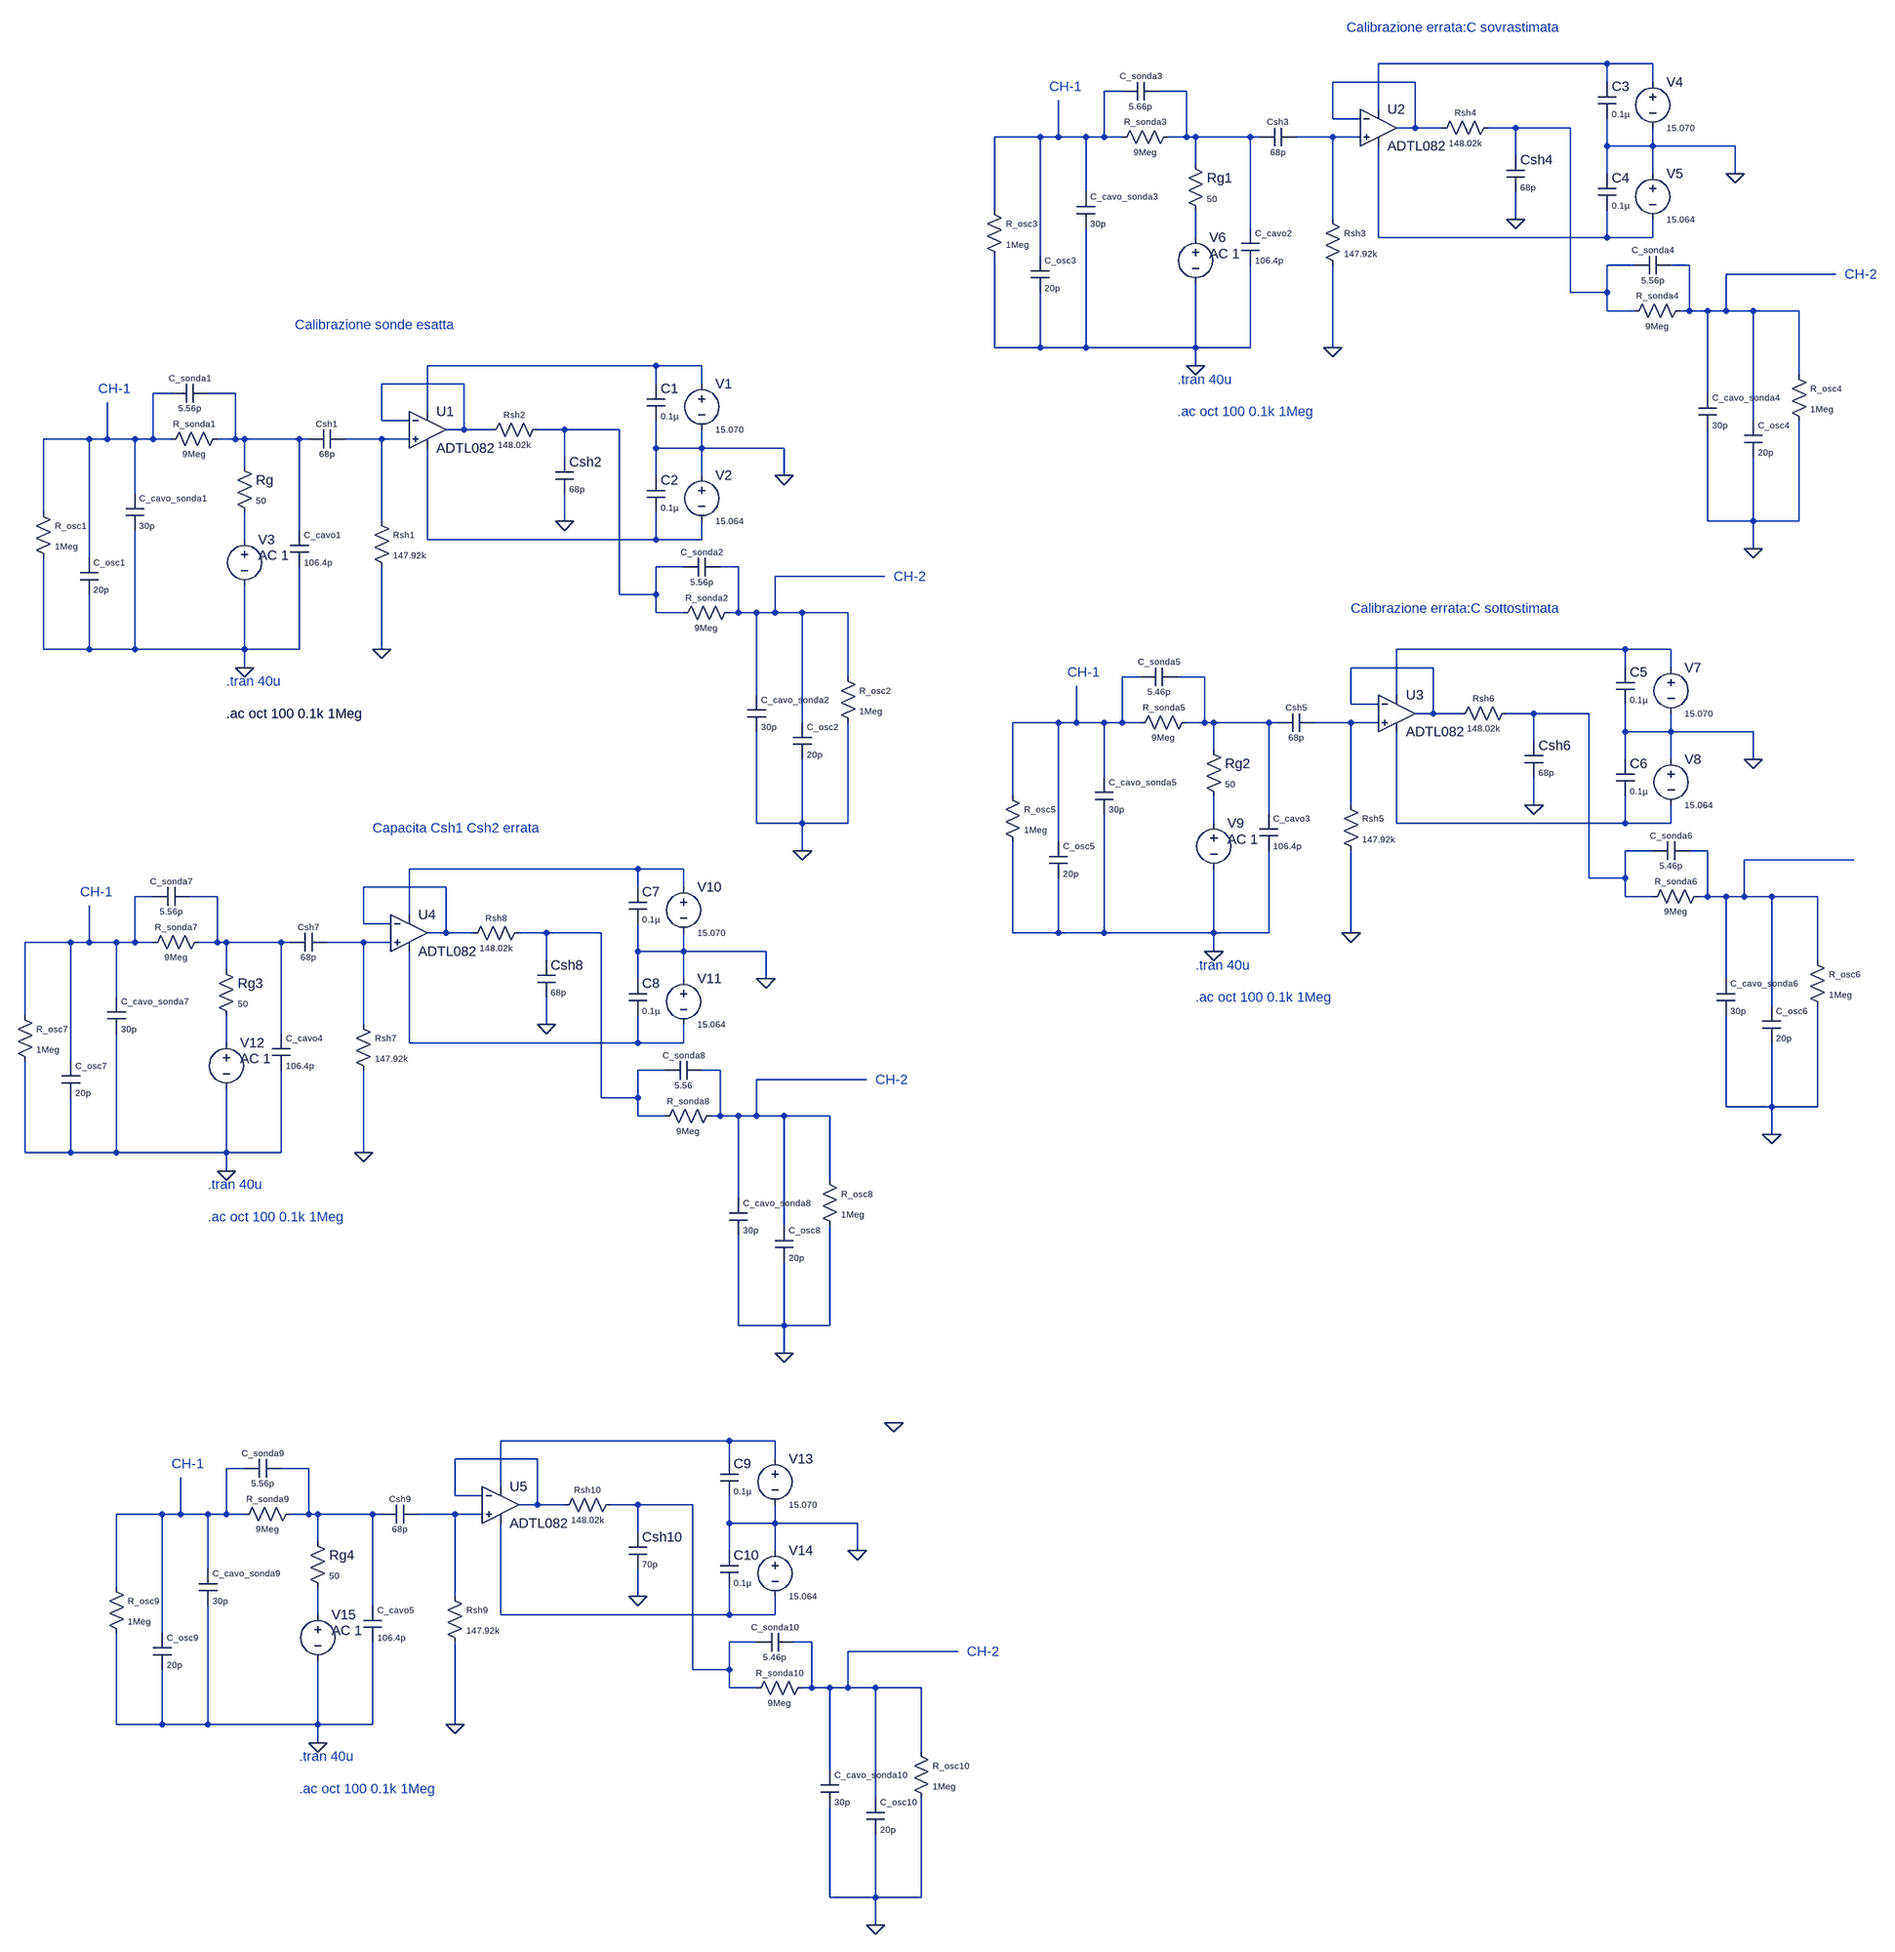
[diagram p0: schematic Shaper_AnFreq2.asc]
Shaper_AnFreq2.asc, the LTspice schematic file:
Version 4.1
SHEET 1 4492 2692
WIRE 2080 -624 1680 -624
WIRE 2160 -624 2080 -624
WIRE 1744 -592 1600 -592
WIRE 2080 -592 2080 -624
WIRE 2160 -592 2160 -624
WIRE 1232 -576 1200 -576
WIRE 1344 -576 1296 -576
WIRE 1680 -544 1680 -624
WIRE 1600 -528 1600 -592
WIRE 1648 -528 1600 -528
WIRE 1744 -512 1744 -592
WIRE 1744 -512 1712 -512
WIRE 1792 -512 1744 -512
WIRE 1920 -512 1872 -512
WIRE 2016 -512 1920 -512
WIRE 1088 -496 1008 -496
WIRE 1120 -496 1120 -560
WIRE 1120 -496 1088 -496
WIRE 1168 -496 1120 -496
WIRE 1200 -496 1200 -576
WIRE 1200 -496 1168 -496
WIRE 1232 -496 1200 -496
WIRE 1344 -496 1344 -576
WIRE 1344 -496 1312 -496
WIRE 1360 -496 1344 -496
WIRE 1456 -496 1360 -496
WIRE 1472 -496 1456 -496
WIRE 1600 -496 1536 -496
WIRE 1648 -496 1600 -496
WIRE 2080 -480 2080 -528
WIRE 2160 -480 2160 -512
WIRE 2160 -480 2080 -480
WIRE 2304 -480 2160 -480
WIRE 1920 -464 1920 -512
WIRE 1360 -448 1360 -496
WIRE 2080 -432 2080 -480
WIRE 2160 -432 2160 -480
WIRE 2304 -432 2304 -480
WIRE 1168 -400 1168 -496
WIRE 1008 -368 1008 -496
WIRE 1600 -352 1600 -496
WIRE 1920 -352 1920 -400
WIRE 1456 -336 1456 -496
WIRE 1360 -320 1360 -368
WIRE 1680 -320 1680 -480
WIRE 2080 -320 2080 -368
WIRE 2080 -320 1680 -320
WIRE 2160 -320 2160 -352
WIRE 2160 -320 2080 -320
WIRE 1088 -288 1088 -496
WIRE 2128 -272 2080 -272
WIRE 2224 -272 2192 -272
WIRE 2480 -256 2288 -256
WIRE 2016 -224 2016 -512
WIRE 2080 -224 2080 -272
WIRE 2080 -224 2016 -224
WIRE 2080 -192 2080 -224
WIRE 2128 -192 2080 -192
WIRE 2224 -192 2224 -272
WIRE 2224 -192 2208 -192
WIRE 2256 -192 2224 -192
WIRE 2288 -192 2288 -256
WIRE 2288 -192 2256 -192
WIRE 2336 -192 2288 -192
WIRE 2416 -192 2336 -192
WIRE 1008 -128 1008 -288
WIRE 1088 -128 1088 -224
WIRE 1088 -128 1008 -128
WIRE 1168 -128 1168 -336
WIRE 1168 -128 1088 -128
WIRE 1360 -128 1360 -240
WIRE 1360 -128 1168 -128
WIRE 1456 -128 1456 -272
WIRE 1456 -128 1360 -128
WIRE 1600 -128 1600 -272
WIRE 416 -96 16 -96
WIRE 496 -96 416 -96
WIRE 1360 -96 1360 -128
WIRE 2416 -80 2416 -192
WIRE 80 -64 -64 -64
WIRE 416 -64 416 -96
WIRE 496 -64 496 -96
WIRE -432 -48 -464 -48
WIRE -320 -48 -368 -48
WIRE 2256 -48 2256 -192
WIRE 16 -16 16 -96
WIRE -64 0 -64 -64
WIRE -16 0 -64 0
WIRE 2336 0 2336 -192
WIRE 80 16 80 -64
WIRE 80 16 48 16
WIRE 128 16 80 16
WIRE 256 16 208 16
WIRE 352 16 256 16
WIRE -576 32 -656 32
WIRE -544 32 -544 -32
WIRE -544 32 -576 32
WIRE -496 32 -544 32
WIRE -464 32 -464 -48
WIRE -464 32 -496 32
WIRE -432 32 -464 32
WIRE -320 32 -320 -48
WIRE -320 32 -352 32
WIRE -304 32 -320 32
WIRE -208 32 -304 32
WIRE -192 32 -208 32
WIRE -64 32 -128 32
WIRE -16 32 -64 32
WIRE 416 48 416 0
WIRE 496 48 496 16
WIRE 496 48 416 48
WIRE 640 48 496 48
WIRE 256 64 256 16
WIRE -304 80 -304 32
WIRE 416 96 416 48
WIRE 496 96 496 48
WIRE 640 96 640 48
WIRE -496 128 -496 32
WIRE -656 160 -656 32
WIRE -64 176 -64 32
WIRE 256 176 256 128
WIRE 2256 176 2256 16
WIRE 2336 176 2336 64
WIRE 2336 176 2256 176
WIRE 2416 176 2416 0
WIRE 2416 176 2336 176
WIRE -208 192 -208 32
WIRE -304 208 -304 160
WIRE 16 208 16 48
WIRE 416 208 416 160
WIRE 416 208 16 208
WIRE 496 208 496 176
WIRE 496 208 416 208
WIRE 2336 224 2336 176
WIRE -576 240 -576 32
WIRE 464 256 416 256
WIRE 560 256 528 256
WIRE 816 272 624 272
WIRE 352 304 352 16
WIRE 416 304 416 256
WIRE 416 304 352 304
WIRE 416 336 416 304
WIRE 464 336 416 336
WIRE 560 336 560 256
WIRE 560 336 544 336
WIRE 592 336 560 336
WIRE 624 336 624 272
WIRE 624 336 592 336
WIRE 672 336 624 336
WIRE 752 336 672 336
WIRE -656 400 -656 240
WIRE -576 400 -576 304
WIRE -576 400 -656 400
WIRE -496 400 -496 192
WIRE -496 400 -576 400
WIRE -304 400 -304 288
WIRE -304 400 -496 400
WIRE -208 400 -208 256
WIRE -208 400 -304 400
WIRE -64 400 -64 256
WIRE 2112 400 1712 400
WIRE 2192 400 2112 400
WIRE -304 432 -304 400
WIRE 1776 432 1632 432
WIRE 2112 432 2112 400
WIRE 2192 432 2192 400
WIRE 752 448 752 336
WIRE 1264 448 1232 448
WIRE 1376 448 1328 448
WIRE 592 480 592 336
WIRE 1712 480 1712 400
WIRE 1632 496 1632 432
WIRE 1680 496 1632 496
WIRE 1776 512 1776 432
WIRE 1776 512 1744 512
WIRE 1824 512 1776 512
WIRE 1952 512 1904 512
WIRE 2048 512 1952 512
WIRE 672 528 672 336
WIRE 1120 528 1040 528
WIRE 1152 528 1152 464
WIRE 1152 528 1120 528
WIRE 1200 528 1152 528
WIRE 1232 528 1232 448
WIRE 1232 528 1200 528
WIRE 1264 528 1232 528
WIRE 1376 528 1376 448
WIRE 1376 528 1344 528
WIRE 1392 528 1376 528
WIRE 1488 528 1392 528
WIRE 1504 528 1488 528
WIRE 1632 528 1568 528
WIRE 1680 528 1632 528
WIRE 2112 544 2112 496
WIRE 2192 544 2192 512
WIRE 2192 544 2112 544
WIRE 2336 544 2192 544
WIRE 1952 560 1952 512
WIRE 1392 576 1392 528
WIRE 2112 592 2112 544
WIRE 2192 592 2192 544
WIRE 2336 592 2336 544
WIRE 1200 624 1200 528
WIRE 1040 656 1040 528
WIRE 1632 672 1632 528
WIRE 1952 672 1952 624
WIRE 1488 688 1488 528
WIRE 592 704 592 544
WIRE 672 704 672 592
WIRE 672 704 592 704
WIRE 752 704 752 528
WIRE 752 704 672 704
WIRE 1392 704 1392 656
WIRE 1712 704 1712 544
WIRE 2112 704 2112 656
WIRE 2112 704 1712 704
WIRE 2192 704 2192 672
WIRE 2192 704 2112 704
WIRE 1120 736 1120 528
WIRE 672 752 672 704
WIRE 2160 752 2112 752
WIRE 2256 752 2224 752
WIRE 2512 768 2320 768
WIRE 384 784 -16 784
WIRE 464 784 384 784
WIRE 2048 800 2048 512
WIRE 2112 800 2112 752
WIRE 2112 800 2048 800
WIRE 48 816 -96 816
WIRE 384 816 384 784
WIRE 464 816 464 784
WIRE -464 832 -496 832
WIRE -352 832 -400 832
WIRE 2112 832 2112 800
WIRE 2160 832 2112 832
WIRE 2256 832 2256 752
WIRE 2256 832 2240 832
WIRE 2288 832 2256 832
WIRE 2320 832 2320 768
WIRE 2320 832 2288 832
WIRE 2368 832 2320 832
WIRE 2448 832 2368 832
WIRE -16 864 -16 784
WIRE -96 880 -96 816
WIRE -48 880 -96 880
WIRE 48 896 48 816
WIRE 48 896 16 896
WIRE 96 896 48 896
WIRE 224 896 176 896
WIRE 320 896 224 896
WIRE 1040 896 1040 736
WIRE 1120 896 1120 800
WIRE 1120 896 1040 896
WIRE 1200 896 1200 688
WIRE 1200 896 1120 896
WIRE 1392 896 1392 784
WIRE 1392 896 1200 896
WIRE 1488 896 1488 752
WIRE 1488 896 1392 896
WIRE 1632 896 1632 752
WIRE -608 912 -688 912
WIRE -576 912 -576 848
WIRE -576 912 -608 912
WIRE -528 912 -576 912
WIRE -496 912 -496 832
WIRE -496 912 -528 912
WIRE -464 912 -496 912
WIRE -352 912 -352 832
WIRE -352 912 -384 912
WIRE -336 912 -352 912
WIRE -240 912 -336 912
WIRE -224 912 -240 912
WIRE -96 912 -160 912
WIRE -48 912 -96 912
WIRE 384 928 384 880
WIRE 464 928 464 896
WIRE 464 928 384 928
WIRE 608 928 464 928
WIRE 1392 928 1392 896
WIRE 224 944 224 896
WIRE 2448 944 2448 832
WIRE -336 960 -336 912
WIRE 384 976 384 928
WIRE 464 976 464 928
WIRE 608 976 608 928
WIRE 2288 976 2288 832
WIRE -528 1008 -528 912
WIRE 2368 1024 2368 832
WIRE -688 1040 -688 912
WIRE -96 1056 -96 912
WIRE 224 1056 224 1008
WIRE -240 1072 -240 912
WIRE -336 1088 -336 1040
WIRE -16 1088 -16 928
WIRE 384 1088 384 1040
WIRE 384 1088 -16 1088
WIRE 464 1088 464 1056
WIRE 464 1088 384 1088
WIRE -608 1120 -608 912
WIRE 432 1136 384 1136
WIRE 528 1136 496 1136
WIRE 784 1152 592 1152
WIRE 320 1184 320 896
WIRE 384 1184 384 1136
WIRE 384 1184 320 1184
WIRE 2288 1200 2288 1040
WIRE 2368 1200 2368 1088
WIRE 2368 1200 2288 1200
WIRE 2448 1200 2448 1024
WIRE 2448 1200 2368 1200
WIRE 384 1216 384 1184
WIRE 432 1216 384 1216
WIRE 528 1216 528 1136
WIRE 528 1216 512 1216
WIRE 560 1216 528 1216
WIRE 592 1216 592 1152
WIRE 592 1216 560 1216
WIRE 640 1216 592 1216
WIRE 720 1216 640 1216
WIRE 2368 1248 2368 1200
WIRE -688 1280 -688 1120
WIRE -608 1280 -608 1184
WIRE -608 1280 -688 1280
WIRE -528 1280 -528 1072
WIRE -528 1280 -608 1280
WIRE -336 1280 -336 1168
WIRE -336 1280 -528 1280
WIRE -240 1280 -240 1136
WIRE -240 1280 -336 1280
WIRE -96 1280 -96 1136
WIRE -336 1312 -336 1280
WIRE 720 1328 720 1216
WIRE 560 1360 560 1216
WIRE 640 1408 640 1216
WIRE 560 1584 560 1424
WIRE 640 1584 640 1472
WIRE 640 1584 560 1584
WIRE 720 1584 720 1408
WIRE 720 1584 640 1584
WIRE 640 1632 640 1584
WIRE 544 1824 144 1824
WIRE 624 1824 544 1824
WIRE 208 1856 64 1856
WIRE 544 1856 544 1824
WIRE 624 1856 624 1824
WIRE -304 1872 -336 1872
WIRE -192 1872 -240 1872
WIRE 144 1904 144 1824
WIRE 64 1920 64 1856
WIRE 112 1920 64 1920
WIRE 208 1936 208 1856
WIRE 208 1936 176 1936
WIRE 256 1936 208 1936
WIRE 384 1936 336 1936
WIRE 480 1936 384 1936
WIRE -448 1952 -528 1952
WIRE -416 1952 -416 1888
WIRE -416 1952 -448 1952
WIRE -368 1952 -416 1952
WIRE -336 1952 -336 1872
WIRE -336 1952 -368 1952
WIRE -304 1952 -336 1952
WIRE -192 1952 -192 1872
WIRE -192 1952 -224 1952
WIRE -176 1952 -192 1952
WIRE -80 1952 -176 1952
WIRE -64 1952 -80 1952
WIRE 64 1952 0 1952
WIRE 112 1952 64 1952
WIRE 544 1968 544 1920
WIRE 624 1968 624 1936
WIRE 624 1968 544 1968
WIRE 768 1968 624 1968
WIRE 384 1984 384 1936
WIRE -176 2000 -176 1952
WIRE 544 2016 544 1968
WIRE 624 2016 624 1968
WIRE 768 2016 768 1968
WIRE -368 2048 -368 1952
WIRE -528 2080 -528 1952
WIRE 64 2096 64 1952
WIRE 384 2096 384 2048
WIRE -80 2112 -80 1952
WIRE -176 2128 -176 2080
WIRE 144 2128 144 1968
WIRE 544 2128 544 2080
WIRE 544 2128 144 2128
WIRE 624 2128 624 2096
WIRE 624 2128 544 2128
WIRE -448 2160 -448 1952
WIRE 592 2176 544 2176
WIRE 688 2176 656 2176
WIRE 944 2192 752 2192
WIRE 480 2224 480 1936
WIRE 544 2224 544 2176
WIRE 544 2224 480 2224
WIRE 544 2256 544 2224
WIRE 592 2256 544 2256
WIRE 688 2256 688 2176
WIRE 688 2256 672 2256
WIRE 720 2256 688 2256
WIRE 752 2256 752 2192
WIRE 752 2256 720 2256
WIRE 800 2256 752 2256
WIRE 880 2256 800 2256
WIRE -528 2320 -528 2160
WIRE -448 2320 -448 2224
WIRE -448 2320 -528 2320
WIRE -368 2320 -368 2112
WIRE -368 2320 -448 2320
WIRE -176 2320 -176 2208
WIRE -176 2320 -368 2320
WIRE -80 2320 -80 2176
WIRE -80 2320 -176 2320
WIRE 64 2320 64 2176
WIRE -176 2352 -176 2320
WIRE 880 2368 880 2256
WIRE 720 2400 720 2256
WIRE 800 2448 800 2256
WIRE 720 2624 720 2464
WIRE 800 2624 800 2512
WIRE 800 2624 720 2624
WIRE 880 2624 880 2448
WIRE 880 2624 800 2624
WIRE 800 2672 800 2624
FLAG -304 432 0
FLAG 672 752 0
FLAG -64 400 0
FLAG 640 96 0
FLAG 256 176 0
FLAG 1360 -96 0
FLAG 2336 224 0
FLAG 1600 -128 0
FLAG 2304 -432 0
FLAG 1920 -352 0
FLAG 1392 928 0
FLAG 2368 1248 0
FLAG 1632 896 0
FLAG 2336 592 0
FLAG 1952 672 0
FLAG -336 1312 0
FLAG 640 1632 0
FLAG -96 1280 0
FLAG 608 976 0
FLAG 224 1056 0
FLAG 832 1792 0
FLAG -176 2352 0
FLAG 800 2672 0
FLAG 64 2320 0
FLAG 768 2016 0
FLAG 384 2096 0
SYMBOL OpAmps\\ADTL082 16 -48 R0
SYMATTR InstName U1
SYMBOL voltage 496 -80 R0
WINDOW 3 24 96 Left 1
WINDOW 123 0 0 Left 0
WINDOW 39 0 0 Left 0
SYMATTR Value 15.070
SYMATTR InstName V1
SYMBOL voltage 496 80 R0
WINDOW 3 24 96 Left 1
WINDOW 123 0 0 Left 0
WINDOW 39 0 0 Left 0
SYMATTR Value 15.064
SYMATTR InstName V2
SYMBOL cap 400 -64 R0
WINDOW 3 24 56 Left 1
SYMATTR Value 0.1µ
SYMATTR InstName C1
SYMBOL cap 400 96 R0
WINDOW 3 24 56 Left 1
SYMATTR Value 0.1µ
SYMATTR InstName C2
SYMBOL voltage -304 192 R0
WINDOW 123 24 44 Left 2
WINDOW 39 0 0 Left 0
WINDOW 3 24 44 Left 2
SYMATTR Value2 AC 1
SYMATTR Value ""
SYMATTR InstName V3
SYMBOL res -320 64 R0
WINDOW 3 36 76 Left 1
SYMATTR Value 50
SYMATTR InstName Rg
SYMBOL res -336 16 R90
WINDOW 0 0 56 VBottom 1
WINDOW 3 32 56 VTop 1
SYMATTR InstName R_sonda1
SYMATTR Value 9Meg
SYMBOL cap -368 -64 R90
WINDOW 0 0 32 VBottom 1
WINDOW 3 32 32 VTop 1
SYMATTR InstName C_sonda1
SYMATTR Value 5.56p
SYMBOL res -672 144 R0
WINDOW 0 36 40 Left 1
WINDOW 3 36 76 Left 1
SYMATTR InstName R_osc1
SYMATTR Value 1Meg
SYMBOL cap -592 240 R0
WINDOW 0 24 8 Left 1
WINDOW 3 24 56 Left 1
SYMATTR InstName C_osc1
SYMATTR Value 20p
SYMBOL cap -512 128 R0
WINDOW 0 24 8 Left 1
WINDOW 3 24 56 Left 1
SYMATTR InstName C_cavo_sonda1
SYMATTR Value 30p
SYMBOL res 560 320 R90
WINDOW 0 0 56 VBottom 1
WINDOW 3 32 56 VTop 1
SYMATTR InstName R_sonda2
SYMATTR Value 9Meg
SYMBOL cap 528 240 R90
WINDOW 0 0 32 VBottom 1
WINDOW 3 32 32 VTop 1
SYMATTR InstName C_sonda2
SYMATTR Value 5.56p
SYMBOL cap 576 480 R0
WINDOW 0 24 8 Left 1
WINDOW 3 24 56 Left 1
SYMATTR InstName C_cavo_sonda2
SYMATTR Value 30p
SYMBOL cap 656 528 R0
WINDOW 0 24 8 Left 1
WINDOW 3 24 56 Left 1
SYMATTR InstName C_osc2
SYMATTR Value 20p
SYMBOL res 736 432 R0
WINDOW 0 36 40 Left 1
WINDOW 3 36 76 Left 1
SYMATTR InstName R_osc2
SYMATTR Value 1Meg
SYMBOL cap -224 256 M180
WINDOW 0 24 56 Left 1
WINDOW 3 24 8 Left 1
SYMATTR InstName C_cavo1
SYMATTR Value 106.4p
SYMBOL res -80 160 R0
WINDOW 0 36 40 Left 1
WINDOW 3 36 76 Left 1
SYMATTR InstName Rsh1
SYMATTR Value 147.92k
SYMBOL cap -128 16 R90
WINDOW 0 0 32 VBottom 1
WINDOW 3 32 32 VTop 1
SYMATTR InstName Csh1
SYMATTR Value 68p
SYMBOL res 224 0 R90
WINDOW 0 0 56 VBottom 1
WINDOW 3 32 56 VTop 1
SYMATTR InstName Rsh2
SYMATTR Value 148.02k
SYMBOL cap 240 64 R0
WINDOW 3 24 56 Left 1
SYMATTR Value 68p
SYMATTR InstName Csh2
SYMBOL OpAmps\\ADTL082 1680 -576 R0
SYMATTR InstName U2
SYMBOL voltage 2160 -608 R0
WINDOW 3 24 96 Left 1
WINDOW 123 0 0 Left 0
WINDOW 39 0 0 Left 0
SYMATTR Value 15.070
SYMATTR InstName V4
SYMBOL voltage 2160 -448 R0
WINDOW 3 24 96 Left 1
WINDOW 123 0 0 Left 0
WINDOW 39 0 0 Left 0
SYMATTR Value 15.064
SYMATTR InstName V5
SYMBOL cap 2064 -592 R0
WINDOW 3 24 56 Left 1
SYMATTR Value 0.1µ
SYMATTR InstName C3
SYMBOL cap 2064 -432 R0
WINDOW 3 24 56 Left 1
SYMATTR Value 0.1µ
SYMATTR InstName C4
SYMBOL voltage 1360 -336 R0
WINDOW 123 24 44 Left 2
WINDOW 39 0 0 Left 0
WINDOW 3 24 44 Left 2
SYMATTR Value2 AC 1
SYMATTR Value ""
SYMATTR InstName V6
SYMBOL res 1344 -464 R0
WINDOW 3 36 76 Left 1
SYMATTR Value 50
SYMATTR InstName Rg1
SYMBOL res 1328 -512 R90
WINDOW 0 0 56 VBottom 1
WINDOW 3 32 56 VTop 1
SYMATTR InstName R_sonda3
SYMATTR Value 9Meg
SYMBOL cap 1296 -592 R90
WINDOW 0 0 32 VBottom 1
WINDOW 3 32 32 VTop 1
SYMATTR InstName C_sonda3
SYMATTR Value 5.66p
SYMBOL res 992 -384 R0
WINDOW 0 36 40 Left 1
WINDOW 3 36 76 Left 1
SYMATTR InstName R_osc3
SYMATTR Value 1Meg
SYMBOL cap 1072 -288 R0
WINDOW 0 24 8 Left 1
WINDOW 3 24 56 Left 1
SYMATTR InstName C_osc3
SYMATTR Value 20p
SYMBOL cap 1152 -400 R0
WINDOW 0 24 8 Left 1
WINDOW 3 24 56 Left 1
SYMATTR InstName C_cavo_sonda3
SYMATTR Value 30p
SYMBOL res 2224 -208 R90
WINDOW 0 0 56 VBottom 1
WINDOW 3 32 56 VTop 1
SYMATTR InstName R_sonda4
SYMATTR Value 9Meg
SYMBOL cap 2192 -288 R90
WINDOW 0 0 32 VBottom 1
WINDOW 3 32 32 VTop 1
SYMATTR InstName C_sonda4
SYMATTR Value 5.56p
SYMBOL cap 2240 -48 R0
WINDOW 0 24 8 Left 1
WINDOW 3 24 56 Left 1
SYMATTR InstName C_cavo_sonda4
SYMATTR Value 30p
SYMBOL cap 2320 0 R0
WINDOW 0 24 8 Left 1
WINDOW 3 24 56 Left 1
SYMATTR InstName C_osc4
SYMATTR Value 20p
SYMBOL res 2400 -96 R0
WINDOW 0 36 40 Left 1
WINDOW 3 36 76 Left 1
SYMATTR InstName R_osc4
SYMATTR Value 1Meg
SYMBOL cap 1440 -272 M180
WINDOW 0 24 56 Left 1
WINDOW 3 24 8 Left 1
SYMATTR InstName C_cavo2
SYMATTR Value 106.4p
SYMBOL res 1584 -368 R0
WINDOW 0 36 40 Left 1
WINDOW 3 36 76 Left 1
SYMATTR InstName Rsh3
SYMATTR Value 147.92k
SYMBOL cap 1536 -512 R90
WINDOW 0 0 32 VBottom 1
WINDOW 3 32 32 VTop 1
SYMATTR InstName Csh3
SYMATTR Value 68p
SYMBOL res 1888 -528 R90
WINDOW 0 0 56 VBottom 1
WINDOW 3 32 56 VTop 1
SYMATTR InstName Rsh4
SYMATTR Value 148.02k
SYMBOL cap 1904 -464 R0
WINDOW 3 24 56 Left 1
SYMATTR Value 68p
SYMATTR InstName Csh4
SYMBOL OpAmps\\ADTL082 1712 448 R0
SYMATTR InstName U3
SYMBOL voltage 2192 416 R0
WINDOW 3 24 96 Left 1
WINDOW 123 0 0 Left 0
WINDOW 39 0 0 Left 0
SYMATTR Value 15.070
SYMATTR InstName V7
SYMBOL voltage 2192 576 R0
WINDOW 3 24 96 Left 1
WINDOW 123 0 0 Left 0
WINDOW 39 0 0 Left 0
SYMATTR Value 15.064
SYMATTR InstName V8
SYMBOL cap 2096 432 R0
WINDOW 3 24 56 Left 1
SYMATTR Value 0.1µ
SYMATTR InstName C5
SYMBOL cap 2096 592 R0
WINDOW 3 24 56 Left 1
SYMATTR Value 0.1µ
SYMATTR InstName C6
SYMBOL voltage 1392 688 R0
WINDOW 123 24 44 Left 2
WINDOW 39 0 0 Left 0
WINDOW 3 24 44 Left 2
SYMATTR Value2 AC 1
SYMATTR Value ""
SYMATTR InstName V9
SYMBOL res 1376 560 R0
WINDOW 3 36 76 Left 1
SYMATTR Value 50
SYMATTR InstName Rg2
SYMBOL res 1360 512 R90
WINDOW 0 0 56 VBottom 1
WINDOW 3 32 56 VTop 1
SYMATTR InstName R_sonda5
SYMATTR Value 9Meg
SYMBOL cap 1328 432 R90
WINDOW 0 0 32 VBottom 1
WINDOW 3 32 32 VTop 1
SYMATTR InstName C_sonda5
SYMATTR Value 5.46p
SYMBOL res 1024 640 R0
WINDOW 0 36 40 Left 1
WINDOW 3 36 76 Left 1
SYMATTR InstName R_osc5
SYMATTR Value 1Meg
SYMBOL cap 1104 736 R0
WINDOW 0 24 8 Left 1
WINDOW 3 24 56 Left 1
SYMATTR InstName C_osc5
SYMATTR Value 20p
SYMBOL cap 1184 624 R0
WINDOW 0 24 8 Left 1
WINDOW 3 24 56 Left 1
SYMATTR InstName C_cavo_sonda5
SYMATTR Value 30p
SYMBOL res 2256 816 R90
WINDOW 0 0 56 VBottom 1
WINDOW 3 32 56 VTop 1
SYMATTR InstName R_sonda6
SYMATTR Value 9Meg
SYMBOL cap 2224 736 R90
WINDOW 0 0 32 VBottom 1
WINDOW 3 32 32 VTop 1
SYMATTR InstName C_sonda6
SYMATTR Value 5.46p
SYMBOL cap 2272 976 R0
WINDOW 0 24 8 Left 1
WINDOW 3 24 56 Left 1
SYMATTR InstName C_cavo_sonda6
SYMATTR Value 30p
SYMBOL cap 2352 1024 R0
WINDOW 0 24 8 Left 1
WINDOW 3 24 56 Left 1
SYMATTR InstName C_osc6
SYMATTR Value 20p
SYMBOL res 2432 928 R0
WINDOW 0 36 40 Left 1
WINDOW 3 36 76 Left 1
SYMATTR InstName R_osc6
SYMATTR Value 1Meg
SYMBOL cap 1472 752 M180
WINDOW 0 24 56 Left 1
WINDOW 3 24 8 Left 1
SYMATTR InstName C_cavo3
SYMATTR Value 106.4p
SYMBOL res 1616 656 R0
WINDOW 0 36 40 Left 1
WINDOW 3 36 76 Left 1
SYMATTR InstName Rsh5
SYMATTR Value 147.92k
SYMBOL cap 1568 512 R90
WINDOW 0 0 32 VBottom 1
WINDOW 3 32 32 VTop 1
SYMATTR InstName Csh5
SYMATTR Value 68p
SYMBOL res 1920 496 R90
WINDOW 0 0 56 VBottom 1
WINDOW 3 32 56 VTop 1
SYMATTR InstName Rsh6
SYMATTR Value 148.02k
SYMBOL cap 1936 560 R0
WINDOW 3 24 56 Left 1
SYMATTR Value 68p
SYMATTR InstName Csh6
SYMBOL OpAmps\\ADTL082 -16 832 R0
SYMATTR InstName U4
SYMBOL voltage 464 800 R0
WINDOW 3 24 96 Left 1
WINDOW 123 0 0 Left 0
WINDOW 39 0 0 Left 0
SYMATTR Value 15.070
SYMATTR InstName V10
SYMBOL voltage 464 960 R0
WINDOW 3 24 96 Left 1
WINDOW 123 0 0 Left 0
WINDOW 39 0 0 Left 0
SYMATTR Value 15.064
SYMATTR InstName V11
SYMBOL cap 368 816 R0
WINDOW 3 24 56 Left 1
SYMATTR Value 0.1µ
SYMATTR InstName C7
SYMBOL cap 368 976 R0
WINDOW 3 24 56 Left 1
SYMATTR Value 0.1µ
SYMATTR InstName C8
SYMBOL voltage -336 1072 R0
WINDOW 123 24 44 Left 2
WINDOW 39 0 0 Left 0
WINDOW 3 24 44 Left 2
SYMATTR Value2 AC 1
SYMATTR Value ""
SYMATTR InstName V12
SYMBOL res -352 944 R0
WINDOW 3 36 76 Left 1
SYMATTR Value 50
SYMATTR InstName Rg3
SYMBOL res -368 896 R90
WINDOW 0 0 56 VBottom 1
WINDOW 3 32 56 VTop 1
SYMATTR InstName R_sonda7
SYMATTR Value 9Meg
SYMBOL cap -400 816 R90
WINDOW 0 0 32 VBottom 1
WINDOW 3 32 32 VTop 1
SYMATTR InstName C_sonda7
SYMATTR Value 5.56p
SYMBOL res -704 1024 R0
WINDOW 0 36 40 Left 1
WINDOW 3 36 76 Left 1
SYMATTR InstName R_osc7
SYMATTR Value 1Meg
SYMBOL cap -624 1120 R0
WINDOW 0 24 8 Left 1
WINDOW 3 24 56 Left 1
SYMATTR InstName C_osc7
SYMATTR Value 20p
SYMBOL cap -544 1008 R0
WINDOW 0 24 8 Left 1
WINDOW 3 24 56 Left 1
SYMATTR InstName C_cavo_sonda7
SYMATTR Value 30p
SYMBOL res 528 1200 R90
WINDOW 0 0 56 VBottom 1
WINDOW 3 32 56 VTop 1
SYMATTR InstName R_sonda8
SYMATTR Value 9Meg
SYMBOL cap 496 1120 R90
WINDOW 0 0 32 VBottom 1
WINDOW 3 32 32 VTop 1
SYMATTR InstName C_sonda8
SYMATTR Value 5.56
SYMBOL cap 544 1360 R0
WINDOW 0 24 8 Left 1
WINDOW 3 24 56 Left 1
SYMATTR InstName C_cavo_sonda8
SYMATTR Value 30p
SYMBOL cap 624 1408 R0
WINDOW 0 24 8 Left 1
WINDOW 3 24 56 Left 1
SYMATTR InstName C_osc8
SYMATTR Value 20p
SYMBOL res 704 1312 R0
WINDOW 0 36 40 Left 1
WINDOW 3 36 76 Left 1
SYMATTR InstName R_osc8
SYMATTR Value 1Meg
SYMBOL cap -256 1136 M180
WINDOW 0 24 56 Left 1
WINDOW 3 24 8 Left 1
SYMATTR InstName C_cavo4
SYMATTR Value 106.4p
SYMBOL res -112 1040 R0
WINDOW 0 36 40 Left 1
WINDOW 3 36 76 Left 1
SYMATTR InstName Rsh7
SYMATTR Value 147.92k
SYMBOL cap -160 896 R90
WINDOW 0 0 32 VBottom 1
WINDOW 3 32 32 VTop 1
SYMATTR InstName Csh7
SYMATTR Value 68p
SYMBOL res 192 880 R90
WINDOW 0 0 56 VBottom 1
WINDOW 3 32 56 VTop 1
SYMATTR InstName Rsh8
SYMATTR Value 148.02k
SYMBOL cap 208 944 R0
WINDOW 3 24 56 Left 1
SYMATTR Value 68p
SYMATTR InstName Csh8
SYMBOL OpAmps\\ADTL082 144 1872 R0
SYMATTR InstName U5
SYMBOL voltage 624 1840 R0
WINDOW 3 24 96 Left 1
WINDOW 123 0 0 Left 0
WINDOW 39 0 0 Left 0
SYMATTR Value 15.070
SYMATTR InstName V13
SYMBOL voltage 624 2000 R0
WINDOW 3 24 96 Left 1
WINDOW 123 0 0 Left 0
WINDOW 39 0 0 Left 0
SYMATTR Value 15.064
SYMATTR InstName V14
SYMBOL cap 528 1856 R0
WINDOW 3 24 56 Left 1
SYMATTR Value 0.1µ
SYMATTR InstName C9
SYMBOL cap 528 2016 R0
WINDOW 3 24 56 Left 1
SYMATTR Value 0.1µ
SYMATTR InstName C10
SYMBOL voltage -176 2112 R0
WINDOW 123 24 44 Left 2
WINDOW 39 0 0 Left 0
WINDOW 3 24 44 Left 2
SYMATTR Value2 AC 1
SYMATTR Value ""
SYMATTR InstName V15
SYMBOL res -192 1984 R0
WINDOW 3 36 76 Left 1
SYMATTR Value 50
SYMATTR InstName Rg4
SYMBOL res -208 1936 R90
WINDOW 0 0 56 VBottom 1
WINDOW 3 32 56 VTop 1
SYMATTR InstName R_sonda9
SYMATTR Value 9Meg
SYMBOL cap -240 1856 R90
WINDOW 0 0 32 VBottom 1
WINDOW 3 32 32 VTop 1
SYMATTR InstName C_sonda9
SYMATTR Value 5.56p
SYMBOL res -544 2064 R0
WINDOW 0 36 40 Left 1
WINDOW 3 36 76 Left 1
SYMATTR InstName R_osc9
SYMATTR Value 1Meg
SYMBOL cap -464 2160 R0
WINDOW 0 24 8 Left 1
WINDOW 3 24 56 Left 1
SYMATTR InstName C_osc9
SYMATTR Value 20p
SYMBOL cap -384 2048 R0
WINDOW 0 24 8 Left 1
WINDOW 3 24 56 Left 1
SYMATTR InstName C_cavo_sonda9
SYMATTR Value 30p
SYMBOL res 688 2240 R90
WINDOW 0 0 56 VBottom 1
WINDOW 3 32 56 VTop 1
SYMATTR InstName R_sonda10
SYMATTR Value 9Meg
SYMBOL cap 656 2160 R90
WINDOW 0 0 32 VBottom 1
WINDOW 3 32 32 VTop 1
SYMATTR InstName C_sonda10
SYMATTR Value 5.46p
SYMBOL cap 704 2400 R0
WINDOW 0 24 8 Left 1
WINDOW 3 24 56 Left 1
SYMATTR InstName C_cavo_sonda10
SYMATTR Value 30p
SYMBOL cap 784 2448 R0
WINDOW 0 24 8 Left 1
WINDOW 3 24 56 Left 1
SYMATTR InstName C_osc10
SYMATTR Value 20p
SYMBOL res 864 2352 R0
WINDOW 0 36 40 Left 1
WINDOW 3 36 76 Left 1
SYMATTR InstName R_osc10
SYMATTR Value 1Meg
SYMBOL cap -96 2176 M180
WINDOW 0 24 56 Left 1
WINDOW 3 24 8 Left 1
SYMATTR InstName C_cavo5
SYMATTR Value 106.4p
SYMBOL res 48 2080 R0
WINDOW 0 36 40 Left 1
WINDOW 3 36 76 Left 1
SYMATTR InstName Rsh9
SYMATTR Value 147.92k
SYMBOL cap 0 1936 R90
WINDOW 0 0 32 VBottom 1
WINDOW 3 32 32 VTop 1
SYMATTR InstName Csh9
SYMATTR Value 68p
SYMBOL res 352 1920 R90
WINDOW 0 0 56 VBottom 1
WINDOW 3 32 56 VTop 1
SYMATTR InstName Rsh10
SYMATTR Value 148.02k
SYMBOL cap 368 1984 R0
WINDOW 3 24 56 Left 1
SYMATTR Value 70p
SYMATTR InstName Csh10
TEXT -336 456 Left 2 ;.tran 40u
TEXT -560 -56 Left 2 ;CH-1
TEXT 832 272 Left 2 ;CH-2
TEXT -216 -168 Left 2 ;Calibrazione sonde esatta
TEXT 1624 -688 Left 2 ;Calibrazione errata:C sovrastimata
TEXT 1632 328 Left 2 ;Calibrazione errata:C sottostimata
TEXT -336 512 Left 2 !.ac oct 100 0.1k 1Meg
TEXT 1328 -72 Left 2 ;.tran 40u
TEXT 1104 -584 Left 2 ;CH-1
TEXT 2496 -256 Left 2 ;CH-2
TEXT 1328 -16 Left 2 ;.ac oct 100 0.1k 1Meg
TEXT 1360 952 Left 2 ;.tran 40u
TEXT 1136 440 Left 2 ;CH-1
TEXT 1360 1008 Left 2 ;.ac oct 100 0.1k 1Meg
TEXT -368 1336 Left 2 ;.tran 40u
TEXT -592 824 Left 2 ;CH-1
TEXT 800 1152 Left 2 ;CH-2
TEXT -368 1392 Left 2 ;.ac oct 100 0.1k 1Meg
TEXT -80 712 Left 2 ;Capacita Csh1 Csh2 errata
TEXT -208 2376 Left 2 ;.tran 40u
TEXT -432 1864 Left 2 ;CH-1
TEXT 960 2192 Left 2 ;CH-2
TEXT -208 2432 Left 2 ;.ac oct 100 0.1k 1Meg

The netlist it stands for:
* Shaper_AnFreq2.asc
X§U1 N015 N011 N010 N017 N011 ADTL082  ; pins In+ In- V+ V- OUT
V1 N010 0 15.070
V2 0 N017 15.064
C1 N010 0 0.1µ
C2 0 N017 0.1µ
V3 N016 0 AC 1
Rg N013 N016 50
R_sonda1 N013 N012 9Meg
C_sonda1 N013 N012 5.56p
R_osc1 N012 0 1Meg
C_osc1 N012 0 20p
C_cavo_sonda1 N012 0 30p
R_sonda2 N018 N014 9Meg
C_sonda2 N018 N014 5.56p
C_cavo_sonda2 N018 0 30p
C_osc2 N018 0 20p
R_osc2 N018 0 1Meg
C_cavo1 0 N013 106.4p
Rsh1 N015 0 147.92k
Csh1 N015 N013 68p
Rsh2 N014 N011 148.02k
Csh2 N014 0 68p
X§U2 N006 N002 N001 N008 N002 ADTL082  ; pins In+ In- V+ V- OUT
V4 N001 0 15.070
V5 0 N008 15.064
C3 N001 0 0.1µ
C4 0 N008 0.1µ
V6 N007 0 AC 1
Rg1 N004 N007 50
R_sonda3 N004 N003 9Meg
C_sonda3 N004 N003 5.66p
R_osc3 N003 0 1Meg
C_osc3 N003 0 20p
C_cavo_sonda3 N003 0 30p
R_sonda4 N009 N005 9Meg
C_sonda4 N009 N005 5.56p
C_cavo_sonda4 N009 0 30p
C_osc4 N009 0 20p
R_osc4 N009 0 1Meg
C_cavo2 0 N004 106.4p
Rsh3 N006 0 147.92k
Csh3 N006 N004 68p
Rsh4 N005 N002 148.02k
Csh4 N005 0 68p
X§U3 N024 N020 N019 N026 N020 ADTL082  ; pins In+ In- V+ V- OUT
V7 N019 0 15.070
V8 0 N026 15.064
C5 N019 0 0.1µ
C6 0 N026 0.1µ
V9 N025 0 AC 1
Rg2 N022 N025 50
R_sonda5 N022 N021 9Meg
C_sonda5 N022 N021 5.46p
R_osc5 N021 0 1Meg
C_osc5 N021 0 20p
C_cavo_sonda5 N021 0 30p
R_sonda6 N027 N023 9Meg
C_sonda6 N027 N023 5.46p
C_cavo_sonda6 N027 0 30p
C_osc6 N027 0 20p
R_osc6 N027 0 1Meg
C_cavo3 0 N022 106.4p
Rsh5 N024 0 147.92k
Csh5 N024 N022 68p
Rsh6 N023 N020 148.02k
Csh6 N023 0 68p
X§U4 N033 N029 N028 N035 N029 ADTL082  ; pins In+ In- V+ V- OUT
V10 N028 0 15.070
V11 0 N035 15.064
C7 N028 0 0.1µ
C8 0 N035 0.1µ
V12 N034 0 AC 1
Rg3 N031 N034 50
R_sonda7 N031 N030 9Meg
C_sonda7 N031 N030 5.56p
R_osc7 N030 0 1Meg
C_osc7 N030 0 20p
C_cavo_sonda7 N030 0 30p
R_sonda8 N036 N032 9Meg
C_sonda8 N036 N032 5.56
C_cavo_sonda8 N036 0 30p
C_osc8 N036 0 20p
R_osc8 N036 0 1Meg
C_cavo4 0 N031 106.4p
Rsh7 N033 0 147.92k
Csh7 N033 N031 68p
Rsh8 N032 N029 148.02k
Csh8 N032 0 68p
X§U5 N042 N038 N037 N044 N038 ADTL082  ; pins In+ In- V+ V- OUT
V13 N037 0 15.070
V14 0 N044 15.064
C9 N037 0 0.1µ
C10 0 N044 0.1µ
V15 N043 0 AC 1
Rg4 N040 N043 50
R_sonda9 N040 N039 9Meg
C_sonda9 N040 N039 5.56p
R_osc9 N039 0 1Meg
C_osc9 N039 0 20p
C_cavo_sonda9 N039 0 30p
R_sonda10 N045 N041 9Meg
C_sonda10 N045 N041 5.46p
C_cavo_sonda10 N045 0 30p
C_osc10 N045 0 20p
R_osc10 N045 0 1Meg
C_cavo5 0 N040 106.4p
Rsh9 N042 0 147.92k
Csh9 N042 N040 68p
Rsh10 N041 N038 148.02k
Csh10 N041 0 70p
* .tran 40u
* CH-1
* CH-2
* Calibrazione sonde esatta
* Calibrazione errata:C sovrastimata
* Calibrazione errata:C sottostimata
.ac oct 100 0.1k 1Meg
* .tran 40u
* CH-1
* CH-2
* .ac oct 100 0.1k 1Meg
* .tran 40u
* CH-1
* .ac oct 100 0.1k 1Meg
* .tran 40u
* CH-1
* CH-2
* .ac oct 100 0.1k 1Meg
* Capacita Csh1 Csh2 errata
* .tran 40u
* CH-1
* CH-2
* .ac oct 100 0.1k 1Meg
.lib ADI.lib
.backanno
.end